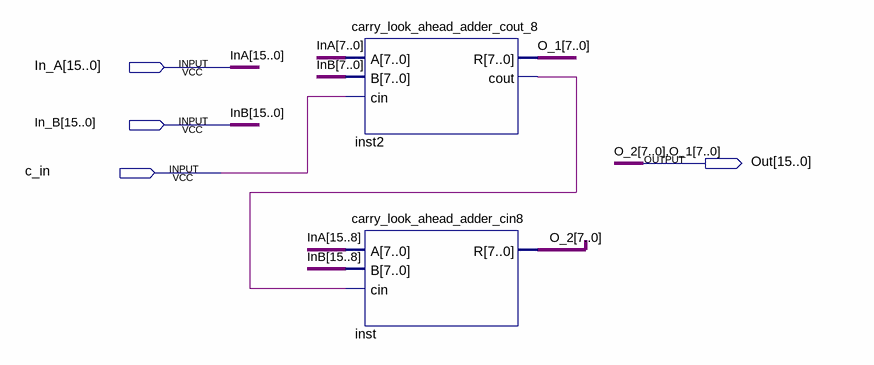
[diagram p0: schematic sheet]
// Quartus schematic two_CLA_8_adders_optimised.bdf as structural Verilog: 2 symbols, 4 pins
module two_CLA_8_adders_optimised (
  input  [15:0] In_A,
  input  [15:0] In_B,
  input  c_in,
  output [15:0] Out
);

  wire inst2_cout;

  carry_look_ahead_adder_cout_8 inst2 (.A(In_A[7:0]), .B(In_B[7:0]), .cin(c_in), .R(Out[7:0]), .cout(inst2_cout));
  carry_look_ahead_adder_cin8 inst (.A(In_A[15:8]), .B(In_B[15:8]), .cin(inst2_cout), .R(Out[15:8]));

  // Other names for the same wires on the sheet: InA[15:0] = In_A; InB[15:0] = In_B; O_1[7:0] = Out[7:0];
  //   O_2[7:0] = Out[15:8]
endmodule
